# Altium schematic sheet Xduino_Uno.SchDoc
size A3
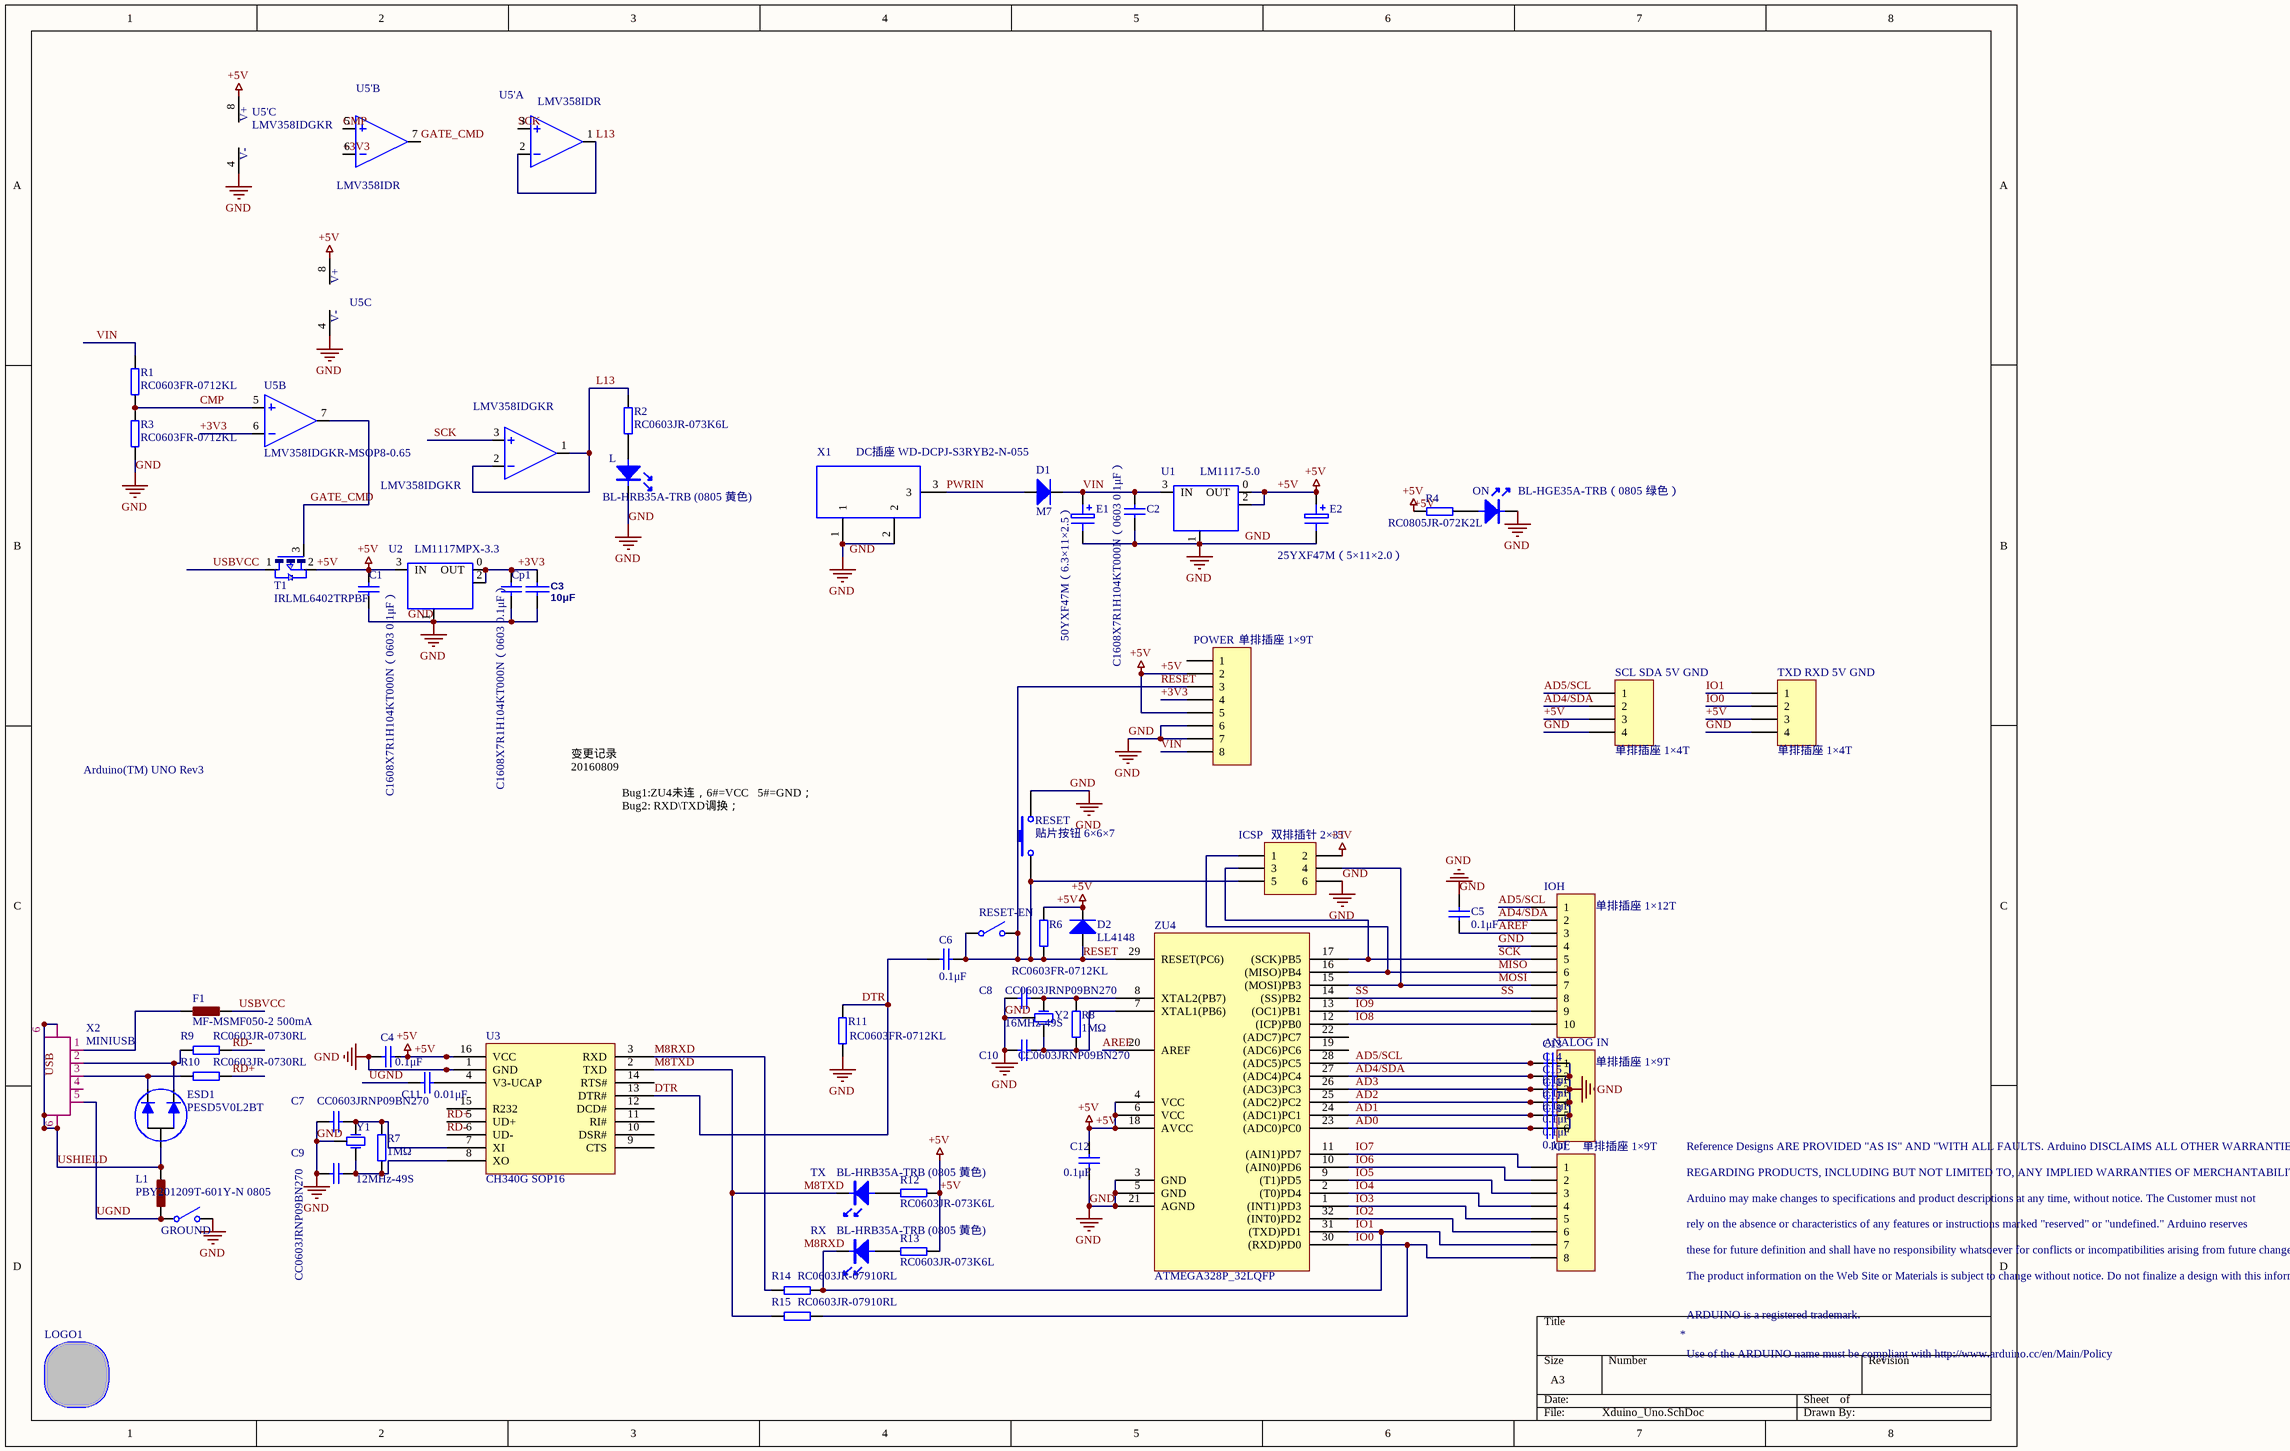
[diagram p0: Xduino_Uno.SchDoc]

## Parts
ANALOG_IN  单排插座 1×9T  [HDR1X6Z]
C1  C1608X7R1H104KT000N（0603 0.1μF）  [0603C]
C2  C1608X7R1H104KT000N（0603 0.1μF）  [0603C]
C3  10μF  [1206C]
C4  0.1μF  [0603C]
C5  0.1μF  [0603C]
C6  0.1μF  [0603C]
C7  CC0603JRNP09BN270  [0603C]
C8  CC0603JRNP09BN270  [0603C]
C9  CC0603JRNP09BN270  [0603C]
C10  CC0603JRNP09BN270  [0603C]
C11  0.01μF  [0603C]
C12  0.1μF  [0603C]
C13  0.1μF  [0603C]
C14  0.1μF  [0603C]
C15  0.1μF  [0603C]
C16  0.1μF  [0603C]
C17  0.1μF  [0603C]
C18  0.1μF  [0603C]
Cp1  C1608X7R1H104KT000N（0603 0.1μF）  [0603C]
D1  M7  [M7]
D2  LL4148  [D1206]
E1  50YXF47M（6.3×11×2.5）  [RB 6.3×11×2.5]
E2  25YXF47M（5×11×2.0）  [RB 6.3×11×2.5]
ESD1  PESD5V0L2BT  [SOT-23]
F1  MF-MSMF050-2 500mA  [L1206]
GROUND  (no value)  [0101]
ICSP  双排插针 2×3T  [HDR2X3]
IOH  单排插座 1×12T  [HDR1X10Z]
IOL  单排插座 1×9T  [HDR1X8Z]
L  BL-HRB35A-TRB (0805 黄色)  [LED0805-Y]
L1  PBY201209T-601Y-N 0805  [L0805]
LOGO1  LOGO  [USB_LOGO]  (value not drawn)
ON  BL-HGE35A-TRB（0805 绿色）  [LED0805-R]
POWER  单排插座 1×9T  [HDR1X8Z]
R1  RC0603FR-0712KL  [0603R]
R2  RC0603JR-073K6L  [0603R]
R3  RC0603FR-0712KL  [0603R]
R4  RC0805JR-072K2L  [0805/R]
R6  RC0603FR-0712KL  [0603R]
R7  1MΩ  [0603R]
R8  1MΩ  [0603R]
R9  RC0603JR-0730RL  [0603R]
R10  RC0603JR-0730RL  [0603R]
R11  RC0603FR-0712KL  [0603R]
R12  RC0603JR-073K6L  [0603R]
R13  RC0603JR-073K6L  [0603R]
R14  RC0603JR-07910RL  [0603R]
R15  RC0603JR-07910RL  [0603R]
RESET  贴片按钮 6×6×7  [按钮/SO]
RESET-EN  (no value)  [0101]
RX  BL-HRB35A-TRB (0805 黄色)  [LED0805-Y]
SCL_SDA_5V_GND  单排插座 1×4T  [HDR1X4Z]
T1  IRLML6402TRPBF  [MOSFET]
TX  BL-HRB35A-TRB (0805 黄色)  [LED0805-Y]
TXD_RXD_5V_GND  单排插座 1×4T  [HDR1X4Z]
U1  LM1117-5.0  [SOT223]
U2  LM1117MPX-3.3  [SOT223]
U3  CH340G SOP16  [SO-16]
U5  LMV358IDGKR  [MSOP8-0.65]  (parts A,B,C of 3)
U5'  LMV358IDR  [so-8]  (parts A,B,C of 3)
U$1  *  [MARK]
X1  DC插座 WD-DCPJ-S3RYB2-N-055  [DC_IN]
X2  MINIUSB  [USB-MINI3]
Y1  12MHz-49S  [XTAL-49S]
Y2  16MHz-49S  [XTAL-49S]
ZU4  ATMEGA328P_32LQFP  [LQFP32]

## Nets
+5V: C1.1 C4.2 C12.2 D2.K E2.1 ICSP.2 POWER.2 POWER.5 R4.2 R6.1 R12.1 R13.1 SCL_SDA_5V_GND.3 T1.2(S) TXD_RXD_5V_GND.3 U1.0(OUT) U1.2(OUT@1) U2.3(IN) U3.16(VCC) U5.8(V+) U5'.8(V+) ZU4.4(VCC) ZU4.6(VCC) ZU4.18(AVCC)
GND: C1.2 C2.1 C3.1 C4.1 C5.2 C7.1 C8.1 C9.1 C10.1 C12.1 C13.1 C14.1 C15.1 C16.1 C17.1 C18.1 Cp1.2 E1.2 E2.2 GROUND.2(NO) ICSP.6 IOH.4 L.K ON.K POWER.6 POWER.7 R3.2 R11.2 RESET.2 SCL_SDA_5V_GND.4 TXD_RXD_5V_GND.4 U1.1(GND/ADJ) U2.1(GND/ADJ) U3.1(GND) U5.4(V-) U5'.4(V-) X1.1 X1.2 Y1.3 Y2.3 ZU4.3(GND) ZU4.5(GND) ZU4.21(AGND)
+3V3: C3.2 Cp1.1 POWER.4 U2.0(OUT) U2.2(OUT@1) U5.6(-IN) U5'.6(-IN)
AD0: ANALOG_IN.6 C18.2 ZU4.23((ADC0)PC0)
AD1: ANALOG_IN.5 C17.2 ZU4.24((ADC1)PC1)
AD2: ANALOG_IN.4 C16.2 ZU4.25((ADC2)PC2)
AD3: ANALOG_IN.3 C15.2 ZU4.26((ADC3)PC3)
AD4/SDA: ANALOG_IN.2 C14.2 IOH.2 SCL_SDA_5V_GND.2 ZU4.27((ADC4)PC4)
AD5/SCL: ANALOG_IN.1 C13.2 IOH.1 SCL_SDA_5V_GND.1 ZU4.28((ADC5)PC5)
AREF: C5.1 IOH.3 ZU4.20(AREF)
CMP: R1.2 R3.1 U5.5(+IN) U5'.5(+IN)
DTR: C6.1 R11.1 U3.13(DTR#)
GATE_CMD: T1.3(G) U5.7(OUT) U5'.7(OUT)
IO0: IOL.8 R15.1 TXD_RXD_5V_GND.2 ZU4.30((RXD)PD0)
IO1: IOL.7 R14.1 RX.K TXD_RXD_5V_GND.1 ZU4.31((TXD)PD1)
IO2: IOL.6 ZU4.32((INT0)PD2)
IO3: IOL.5 ZU4.1((INT1)PD3)
IO4: IOL.4 ZU4.2((T0)PD4)
IO5: IOL.3 ZU4.9((T1)PD5)
IO6: IOL.2 ZU4.10((AIN0)PD6)
IO7: IOL.1 ZU4.11((AIN1)PD7)
IO8: IOH.10 ZU4.12((ICP)PB0)
IO9: IOH.9 ZU4.13((OC1)PB1)
L13: R2.1 U5.1(OUT) U5.2(-IN) U5'.1(OUT) U5'.2(-IN)
M8RXD: R14.2 U3.3(RXD)
M8TXD: R15.2 TX.K U3.2(TXD)
MISO: ICSP.1 IOH.6 ZU4.16((MISO)PB4)
MOSI: ICSP.4 IOH.7 ZU4.15((MOSI)PB3)
PWRIN: D1.A X1.3
RD+: R10.1 U3.5(UD+)
RD-: R9.1 U3.6(UD-)
RESET: C6.2 D2.A ICSP.5 POWER.3 R6.2 RESET.1 RESET-EN.1(COMMON) RESET-EN.2(NO) ZU4.29(RESET(PC6))
SCK: ICSP.3 IOH.5 U5.3(+IN) U5'.3(+IN) ZU4.17((SCK)PB5)
SS: IOH.8 ZU4.14((SS)PB2)
UGND: C11.2 GROUND.1(COMMON) L1.2 X2.5
USBVCC: F1.1 T1.1(D)
USHIELD: ESD1.3 L1.1 X2.6 X2.?1 X2.?2
VIN: C2.2 D1.K E1.1 POWER.8 R1.1 U1.3(IN)
NetC7_2: C7.2 R7.1 U3.7(XI) Y1.1(OSC1)
NetC8_2: C8.2 R8.1 Y2.1(OSC1) ZU4.8(XTAL2(PB7))
NetC9_2: C9.2 R7.2 U3.8(XO) Y1.2(OSC2)
NetC10_2: C10.2 R8.2 Y2.2(OSC2) ZU4.7(XTAL1(PB6))
NetC11_1: C11.1 U3.4(V3-UCAP)
NetESD1_1: ESD1.1 R9.2 X2.2
NetESD1_2: ESD1.2 R10.2 X2.3
NetF1_2: F1.2 X2.1
NetL_A: L.A R2.2
NetON_A: ON.A R4.1
NetR12_2: R12.2 TX.A
NetR13_2: R13.2 RX.A

Not connected (* = marked no-connect by the designer): POWER 1; U3 9(CTS) 10(DSR#) 11(RI#) 12(DCD#) 14(RTS#) 15(R232); X2 4; ZU4 19((ADC6)PC6) 22((ADC7)PC7)

## Notes on the sheet
- Arduino(TM) UNO Rev3
- 变更记录
  20160809
  Bug1:ZU4未连，6#=VCC   5#=GND；
  Bug2: RXD\TXD调换；
- (near U$1) Use of the ARDUINO name must be compliant with http://www.arduino.cc/en/Main/Policy
- Labels drawn without touching a wire or pin: GND, M8RXD
- (in symbol DISCLAIMER) Reference Designs ARE PROVIDED "AS IS" AND "WITH ALL FAULTS. Arduino DISCLAIMS ALL OTHER WARRANTIES, EXPRESS OR IMPLIED,; REGARDING PRODUCTS, INCLUDING BUT NOT LIMITED TO, ANY IMPLIED WARRANTIES OF MERCHANTABILITY OR FITNESS FOR A PARTICULAR PURPOSE; Arduino may make changes to specifications and product descriptions at any time, without notice. The Customer must not; rely on the absence or characteristics of any features or instructions marked "reserved" or "undefined." Arduino reserves; these for future definition and shall have no responsibility whatsoever for conflicts or incompatibilities arising from future changes to them.; The product information on the Web Site or Materials is subject to change without notice. Do not finalize a design with this information.; ARDUINO is a registered trademark.

## Library data of the parts
ANALOG_IN = Header 6: Header, 6-Pin; LatestRevisionDate: 17-Jul-2002; LatestRevisionNote: Re-released for DXP Platform.; Publisher: Altium Limited
C1 Cp1 = Cap: Capacitor; Value: 100pF; Published: 8-Jun-2000; LatestRevisionDate: 17-Jul-2002; LatestRevisionNote: Re-released for DXP Platform.; PackageReference: RAD-0.3; Publisher: Altium Limited; PackageDescription: Radial Cap, Thru-Hole; 2 Leads; 0.3 in Pin Spacing
C2 C4-C18 = Cap: Capacitor; Published: 8-Jun-2000; LatestRevisionDate: 17-Jul-2002; LatestRevisionNote: Re-released for DXP Platform.; PackageReference: RAD-0.3; Publisher: Altium Limited; PackageDescription: Radial Cap, Thru-Hole; 2 Leads; 0.3 in Pin Spacing
C3 = CAP: Capacitor
D1 D2 = M7: D
E1 E2 = E
ESD1 = ESD1
F1 L1 = L: BLM21
GROUND RESET-EN = SW-SPST: Single-Pole, Single-Throw Switch; Published: 24-Mar-1999; LatestRevisionDate: 17-Jul-2002; LatestRevisionNote: Re-released for DXP Platform.; PackageReference: SPST-2; Publisher: Altium Limited; PackageDescription: Switch; 2 Leads
ICSP = Header 3X2: Header, 3-Pin, Dual row; LatestRevisionDate: 17-Jul-2002; LatestRevisionNote: Re-released for DXP Platform.; Publisher: Altium Limited
IOH = Header 10: Header, 10-Pin; LatestRevisionDate: 17-Jul-2002; LatestRevisionNote: Re-released for DXP Platform.; Publisher: Altium Limited
IOL POWER = Header 8: Header, 8-Pin; LatestRevisionDate: 17-Jul-2002; LatestRevisionNote: Re-released for DXP Platform.; Publisher: Altium Limited
L ON RX TX = LED
R1-R4 R6-R15 = R: Resistor
RESET = SW-PB: Switch; Published: 24-Mar-1999; LatestRevisionDate: 17-Jul-2002; LatestRevisionNote: Re-released for DXP Platform.; PackageReference: SPST-2; Publisher: Altium Limited; PackageDescription: Switch; 2 Leads
SCL_SDA_5V_GND TXD_RXD_5V_GND = Header 4: Header, 4-Pin; LatestRevisionDate: 17-Jul-2002; LatestRevisionNote: Re-released for DXP Platform.; Publisher: Altium Limited
T1 = PMOSSOT23
U1 U2 = LM1117
U3 = CH340G
U5 U5' = LMV358MMX
U$1 = DISCLAIMER
X1 = DC_IN: POWERSUPPLY_DC21MMX
X2 = USB-B_MINI: USB
Y1 Y2 = XTAL1: 3pXTAL
ZU4 = ATMEGA328P_32LQFP: Arduino ATMEGA328P